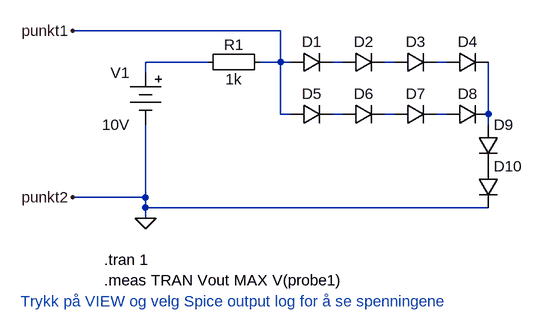
[diagram p0: schematic DC-R8D2S.asc]
DC-R8D2S.asc, the LTspice schematic file:
Version 4
SHEET 1 880 680
WIRE -64 64 -384 64
WIRE -176 112 -272 112
WIRE -64 112 -64 64
WIRE -64 112 -96 112
WIRE -48 112 -64 112
WIRE 32 112 16 112
WIRE 112 112 96 112
WIRE 192 112 176 112
WIRE -272 128 -272 112
WIRE -64 192 -64 112
WIRE -48 192 -64 192
WIRE 32 192 16 192
WIRE 112 192 96 192
WIRE 192 192 176 192
WIRE 256 192 256 112
WIRE 256 208 256 192
WIRE -272 320 -272 208
WIRE -272 320 -384 320
WIRE -272 336 -272 320
WIRE 256 336 -272 336
WIRE -272 352 -272 336
FLAG -272 352 0
FLAG -384 64 punkt1
FLAG -384 320 punkt2
SYMBOL diode -48 128 R270
WINDOW 0 32 32 VTop 2
WINDOW 3 0 32 Invisible 2
SYMATTR InstName D1
SYMBOL diode 32 128 R270
WINDOW 0 32 32 VTop 2
WINDOW 3 0 32 Invisible 2
SYMATTR InstName D2
SYMBOL diode 112 128 R270
WINDOW 0 32 32 VTop 2
WINDOW 3 0 32 Invisible 2
SYMATTR InstName D3
SYMBOL diode 192 128 R270
WINDOW 0 32 32 VTop 2
WINDOW 3 0 32 Invisible 2
SYMATTR InstName D4
SYMBOL diode -48 208 R270
WINDOW 0 32 32 VTop 2
WINDOW 3 0 32 Invisible 2
SYMATTR InstName D5
SYMBOL diode 32 208 R270
WINDOW 0 32 32 VTop 2
WINDOW 3 0 32 Invisible 2
SYMATTR InstName D6
SYMBOL diode 112 208 R270
WINDOW 0 32 32 VTop 2
WINDOW 3 0 32 Invisible 2
SYMATTR InstName D7
SYMBOL diode 192 208 R270
WINDOW 0 32 32 VTop 2
WINDOW 3 0 32 Invisible 2
SYMATTR InstName D8
SYMBOL Misc\\battery -272 112 M0
WINDOW 123 0 0 Left 0
WINDOW 39 0 0 Left 0
SYMATTR InstName V1
SYMATTR Value 10V
SYMBOL Misc\\EuropeanResistor -80 96 R90
WINDOW 0 5 56 VBottom 2
WINDOW 3 27 56 VTop 2
SYMATTR InstName R1
SYMATTR Value 1k
SYMBOL diode 240 208 R0
WINDOW 3 24 64 Invisible 2
SYMATTR InstName D9
SYMBOL diode 240 272 R0
WINDOW 3 24 64 Invisible 2
SYMATTR InstName D10
TEXT -336 416 Left 2 !.tran 1\n.meas TRAN Vout MAX V(probe1)
TEXT -464 480 Left 2 ;Trykk på VIEW og velg Spice output log for å se spenningene

The netlist it stands for:
* DC-R8D2S.asc
D1 punkt1 N002 D
D2 N002 N003 D
D3 N003 N004 D
D4 N004 N008 D
D5 punkt1 N005 D
D6 N005 N006 D
D7 N006 N007 D
D8 N007 N008 D
V1 N001 0 10V
R1 punkt1 N001 1k
D9 N008 P001 D
D10 P001 0 D
.model D D
.lib standard.dio
.tran 1
.meas TRAN Vout MAX V(probe1)
* Trykk på VIEW og velg Spice output log for å se spenningene
.backanno
.end